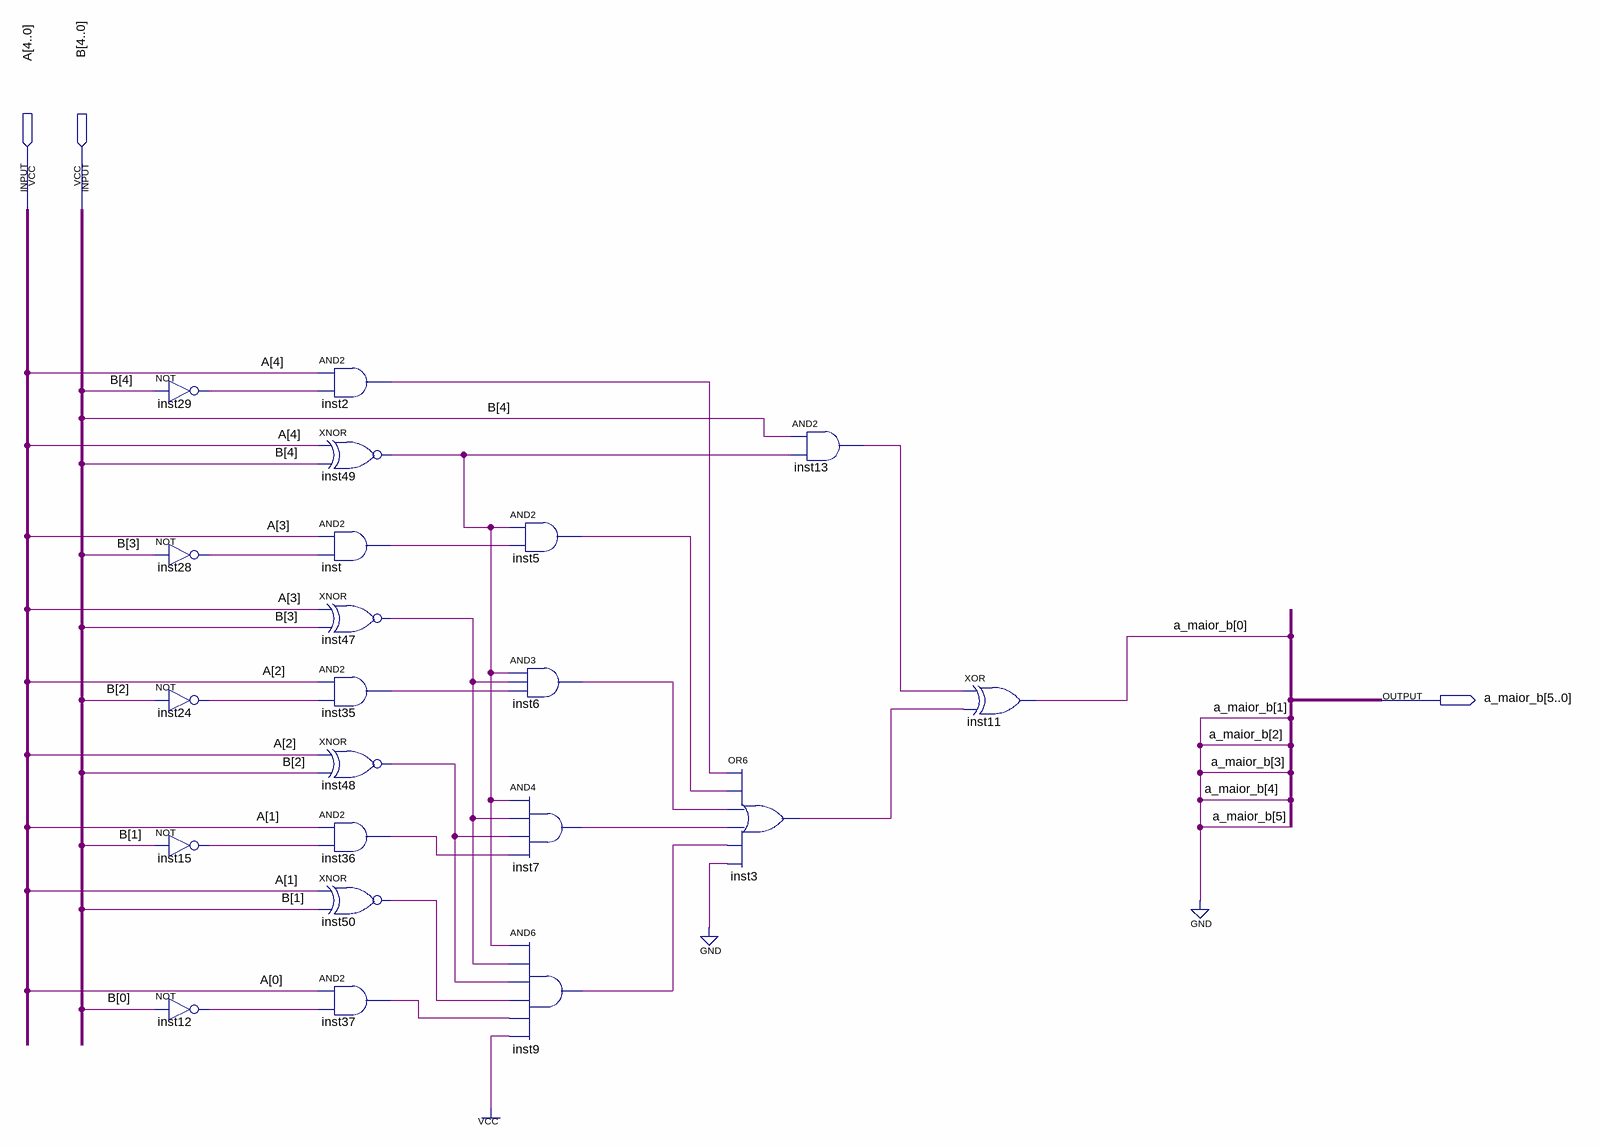
[diagram p0: schematic sheet]
// Quartus schematic eclb_A_maior_B_5bits_magnitude.bdf as structural Verilog: 21 symbols, 3 pins
module eclb_A_maior_B_5bits_magnitude (
  input  [4:0] A,
  input  [4:0] B,
  output [5:0] a_maior_b
);

  wire inst2_out, inst3_out, inst5_out, inst6_out, inst7_out, inst9_out, inst12_out, inst13_out, inst15_out,
       inst24_out, inst28_out, inst29_out, inst35_out, inst36_out, inst37_out, inst47_out, inst48_out,
       inst49_out, inst50_out, inst_out;

  not inst29 (inst29_out, B[4]);
  not inst28 (inst28_out, B[3]);
  not inst24 (inst24_out, B[2]);
  not inst15 (inst15_out, B[1]);
  not inst12 (inst12_out, B[0]);
  and inst2 (inst2_out, A[4], inst29_out);
  xnor inst49 (inst49_out, A[4], B[4]);
  and inst (inst_out, A[3], inst28_out);
  xnor inst47 (inst47_out, A[3], B[3]);
  and inst35 (inst35_out, A[2], inst24_out);
  xnor inst48 (inst48_out, A[2], B[2]);
  and inst36 (inst36_out, A[1], inst15_out);
  xnor inst50 (inst50_out, A[1], B[1]);
  and inst37 (inst37_out, A[0], inst12_out);
  and inst5 (inst5_out, inst49_out, inst_out);
  and inst6 (inst6_out, inst49_out, inst47_out, inst35_out);
  and inst7 (inst7_out, inst49_out, inst47_out, inst48_out, inst36_out);
  and inst9 (inst9_out, inst49_out, inst47_out, inst48_out, inst50_out, inst37_out, 1'b1);
  or inst3 (inst3_out, inst2_out, inst5_out, inst6_out, inst7_out, inst9_out, 1'b0);
  and inst13 (inst13_out, B[4], inst49_out);
  xor inst11 (a_maior_b[0], inst13_out, inst3_out);

  assign a_maior_b[5:1] = {5{1'b0}};
endmodule
